# EAGLE design txb0108 (EAGLE 6.1)
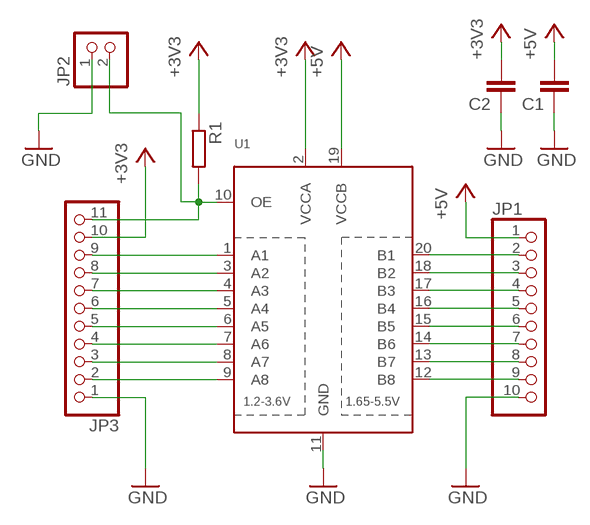
[diagram p0: schematic, sheet 1]

## Parts
C1  C-EUC0805K  [C0805K]
C2  C-EUC1206  [C1206]
JP1  PINHD-1X10  [1X10]
JP2  PINHD-1X2  [1X02]
JP3  PINHD-1X11  [1X11]
R1  R-EU_M0805  [M0805]
U1  TXB0108PWR  [TSSOP20]

## Nets
+3V3: C2.2 JP3.10 R1.1 U1.2(VCCA)
+5V: C1.2 JP1.1 U1.19(VCCB)
GND: C1.1 C2.1 JP1.10 JP2.1 JP3.1 U1.11(GND)
N$1: JP1.2 U1.20(B1)
N$2: JP1.3 U1.18(B2)
N$3: JP1.4 U1.17(B3)
N$4: JP1.5 U1.16(B4)
N$5: JP1.6 U1.15(B5)
N$6: JP1.7 U1.14(B6)
N$7: JP1.8 U1.13(B7)
N$8: JP1.9 U1.12(B8)
N$9: JP3.2 U1.9(A8)
N$10: JP3.3 U1.8(A7)
N$11: JP3.4 U1.7(A6)
N$12: JP3.5 U1.6(A5)
N$13: JP3.6 U1.5(A4)
N$14: JP3.7 U1.4(A3)
N$15: JP3.8 U1.3(A2)
N$16: JP3.9 U1.1(A1)
N$17: JP2.2 JP3.11 R1.2 U1.10(OE)

## Library data of the parts
C1 C2 = rcl:C-EU: CAPACITOR, European symbol
JP1 = pinhead:PINHD-1X10: PIN HEADER
JP2 = pinhead:PINHD-1X2: PIN HEADER
JP3 = pinhead:PINHD-1X11: PIN HEADER
R1 = rcl:R-EU_: RESISTOR, European symbol
U1 = adafruit:TXB0108PWR: 8-Bit Bi-Directional Level Shifter 1.2V-3.6V (VCCA) to 1.65V-5.5V (VCCB) bi-directional level shifter with auto direction sensing. Max data rate - VCCA 1.8V: 20Mbps (50ns), VCCA 3.3V: 100Mbps (10ns) Digikey: 296-21527-1-ND

## Board
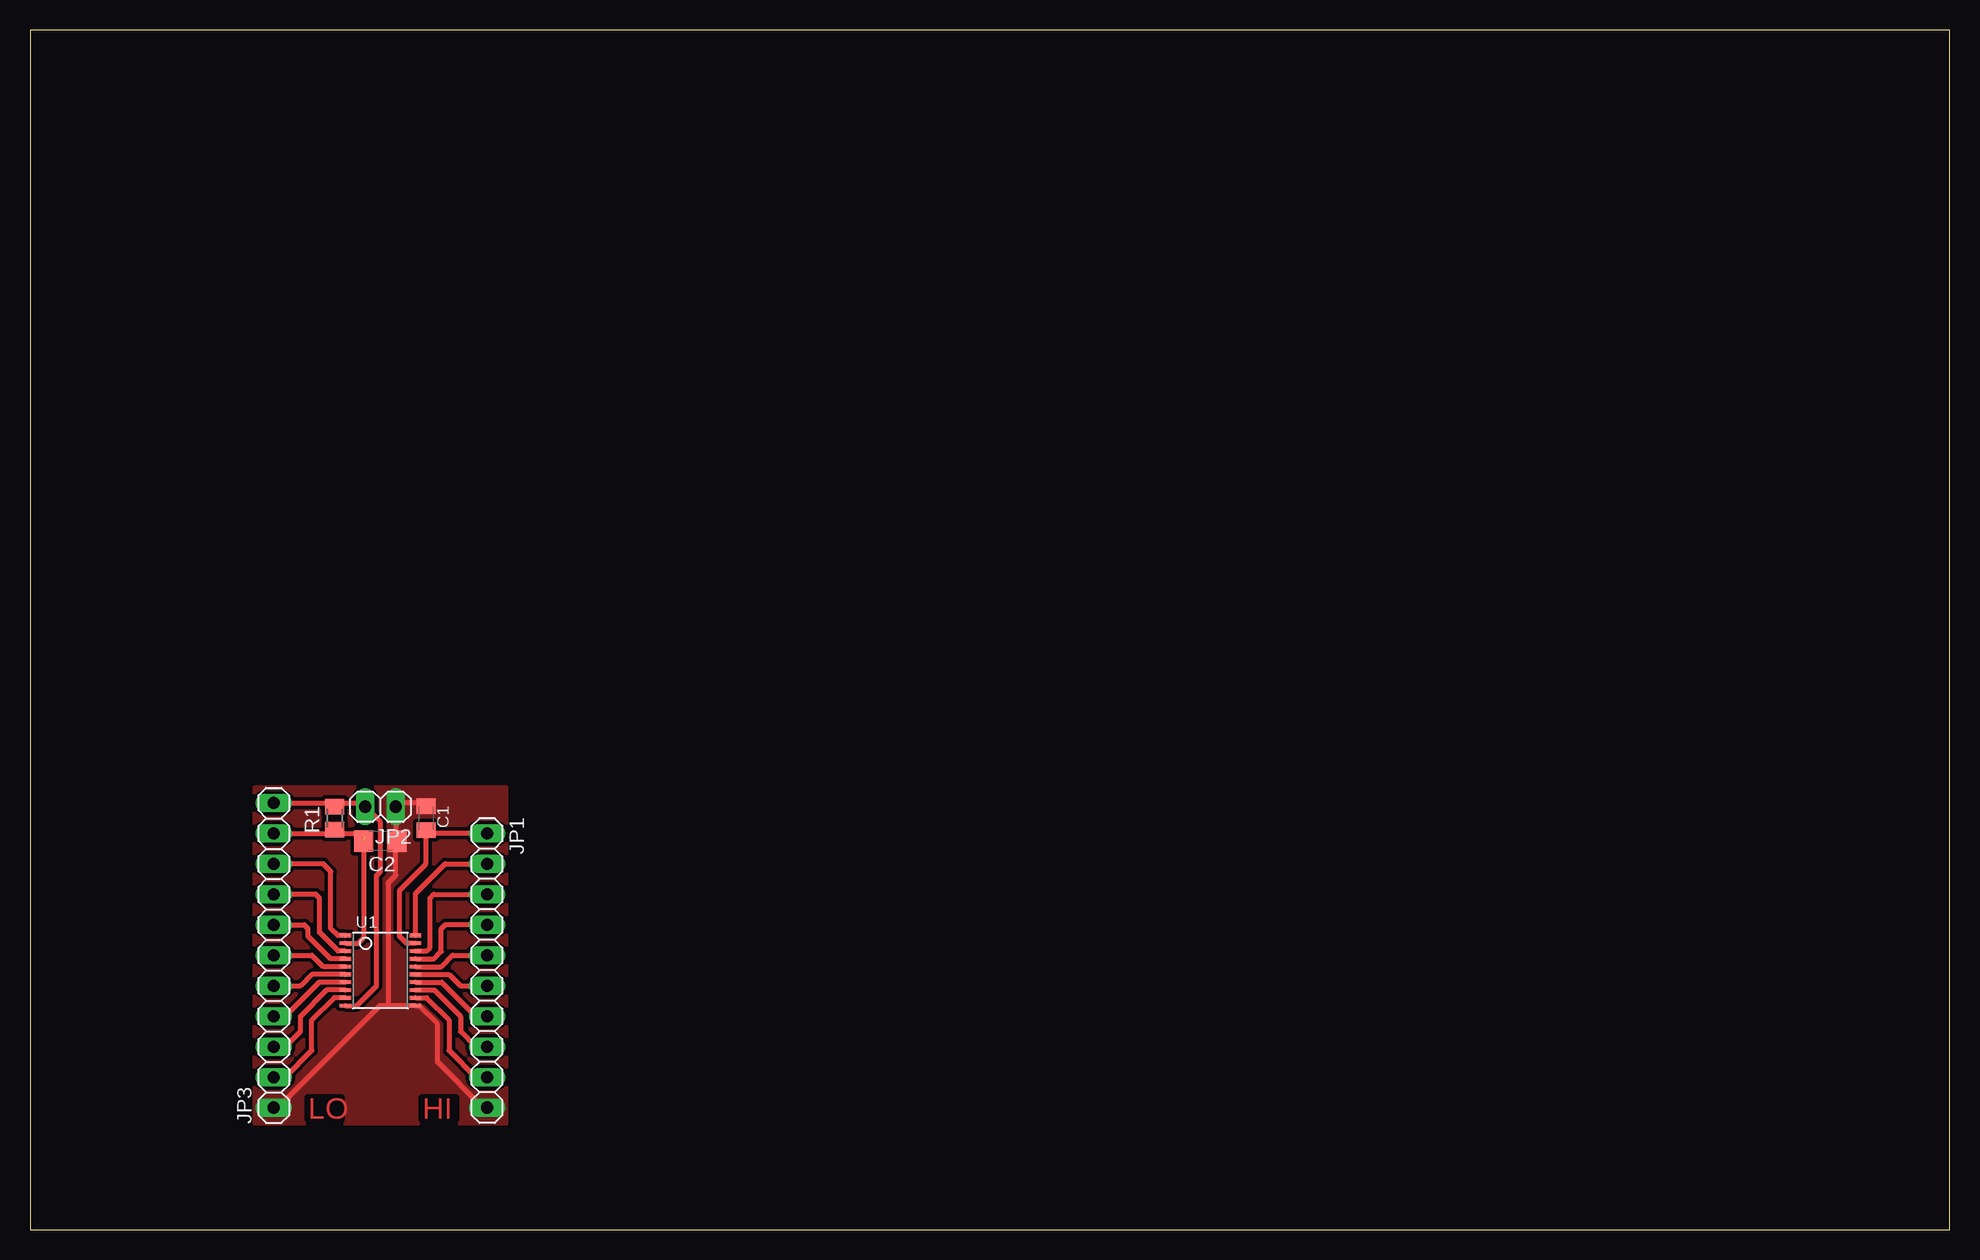
[diagram p1: board, top side]

Size 160 x 100 mm. Coordinates in mm from the lower left corner, seen from the top.
Outline: 0,0 160,0 160,100 0,100 0,0
Copper layers (1*16): Top 0.035mm / dielectric 1.5mm / Bottom 0.035mm
Design rules: minimum track width 10mil, minimum drill 24mil, track to track 12mil, track to pad 12mil, pad to pad 12mil, via to via 12mil, smd to smd 10mil, copper to edge 12mil, drill to drill 12mil, minimum pad ring 10mil, minimum via ring 10mil, stop-mask expansion 4mil, vias tented up to drill 0mil, thermal gap 12mil

### Footprints (pad centres in the part's own frame; a part is rotated, then mirrored left to right if it is on the bottom)
C0805K = smd 1.3 x 1.6: 1 -1,0; 2 1,0
C1206 = smd 1.6 x 1.8: 1 -1.4,0; 2 1.4,0
1X10 = drill 1.016 long: 1 -11.43,0; 2 -8.89,0; 3 -6.35,0; 4 -3.81,0; 5 -1.27,0; 6 1.27,0; 7 3.81,0; 8 6.35,0; 9 8.89,0; 10 11.43,0
1X02 = drill 1.016 long: 1 -1.27,0; 2 1.27,0
1X11 = drill 1.016 long: 1 -12.7,0; 2 -10.16,0; 3 -7.62,0; 4 -5.08,0; 5 -2.54,0; 6 0,0; 7 2.54,0; 8 5.08,0; 9 7.62,0; 10 10.16,0; 11 12.7,0
M0805 = smd 1.3 x 1.6: 1 -0.95,0; 2 0.95,0
TSSOP20 = smd 0.305 x 0.991: 1 -2.925,-2.918; 2 -2.275,-2.918; 3 -1.625,-2.918; 4 -0.975,-2.918; 5 -0.325,-2.918; 6 0.325,-2.918; 7 0.975,-2.918; 8 1.625,-2.918; 9 2.275,-2.918; 10 2.925,-2.918; 11 2.925,2.918; 12 2.275,2.918; 13 1.625,2.918; 14 0.975,2.918; 15 0.325,2.918; 16 -0.325,2.918; 17 -0.975,2.918; 18 -1.625,2.918; 19 -2.275,2.918; 20 -2.925,2.918

### Placement (x,y rotation side)
C1  33.02,34.29 270 top
C2  29.21,32.38 180 top
JP1  38.1,21.59 270 top
JP2  29.21,35.24 180 top
JP3  20.32,22.86 90 top
R1  25.4,34.29 90 top
U1  29.21,21.59 270 top

### Tracks (layer width: path | path; a pad name or v marks a point on that pad's centre or on a via)
+3V3  (1 unrouted)
  Top 0.406: JP3.10 25.4,33.02 | 25.4,33.02 27.62,33.02 27.94,32.7 | R1.1 25.4,33.02 | C2.2 27.81,24.32 27.36,23.86 U1.2
+5V
  Top 0.406: JP1.1 33.29,33.02 C1.2 33.02,30.48 30.8,28.26 30.8,24.45 31.38,23.86 U1.19
GND
  Top 0.406: C1.1 33.02,35.24 32.7,35.56 30.8,35.56 JP2.1 30.48,32.83 C2.1 30.48,32.7 30.48,29.53 29.84,28.89 29.84,18.73 29.91,18.66 | 29.91,18.66 U1.11 32.45,18.66 33.97,17.14 33.97,13.97 37.78,10.16 JP1.10 | 29.91,18.66 29.14,18.66 20.64,10.16 JP3.1
  pour Top (no thermals): 18.73,8.89 39.69,8.89 39.69,36.83 18.73,36.83
N$1
  Top 0.406: U1.20 32.13,28 34.61,30.48 JP1.2
N$2
  Top 0.406: U1.18 33.06,23.21 33.34,23.5 33.34,27.62 33.66,27.94 JP1.3
N$3
  Top 0.406: U1.17 33.68,22.57 34.29,23.18 34.29,25.08 34.61,25.4 JP1.4
N$4
  Top 0.406: U1.16 34.3,21.91 35.24,22.86 JP1.5
N$5
  Top 0.406: U1.15 34.93,21.27 35.88,20.32 JP1.6
N$6
  Top 0.406: U1.14 34.31,20.61 37.15,17.78 JP1.7
N$7
  Top 0.406: U1.13 33.69,19.96 35.88,17.78 35.88,16.51 37.15,15.24 JP1.8
N$8
  Top 0.406: U1.12 33.07,19.32 34.92,17.46 34.92,14.92 37.15,12.7 JP1.9
N$9
  Top 0.406: JP3.2 21.27,12.7 23.5,14.92 23.5,17.46 25.35,19.32 U1.9
N$10
  Top 0.406: U1.8 24.73,19.96 22.54,17.78 22.54,16.51 21.27,15.24 JP3.3
N$11
  Top 0.406: U1.7 24.11,20.61 21.27,17.78 JP3.4
N$12
  Top 0.406: U1.6 23.49,21.27 22.54,20.32 JP3.5
N$13
  Top 0.406: U1.5 24.44,21.91 23.5,22.86 JP3.6
N$14
  Top 0.406: JP3.7 22.86,25.4 23.18,25.08 23.18,24.45 25.06,22.57 U1.4
N$15
  Top 0.406: U1.3 25.68,23.21 24.13,24.77 24.13,27.62 23.81,27.94 JP3.8
N$16
  Top 0.406: U1.1 25.65,24.52 25.08,25.08 25.08,29.84 24.45,30.48 JP3.9
N$17
  Top 0.406: U1.10 27.24,18.66 28.89,20.32 28.89,29.53 29.21,29.84 29.21,33.97 JP2.2 27.62,35.56 25.4,35.56 | JP3.11 25.4,35.56 | R1.2 25.4,35.56

### Text on the board
Top: LO | HI